# EAGLE design Hooly_2.023 (EAGLE 8.5.1)
SHT31 con connettore Tutto 1206 anzichè 0603 Con regolatore all'ingresso Variante Con quarzo non SMD Partitore a VBATT per misurare livello batteria
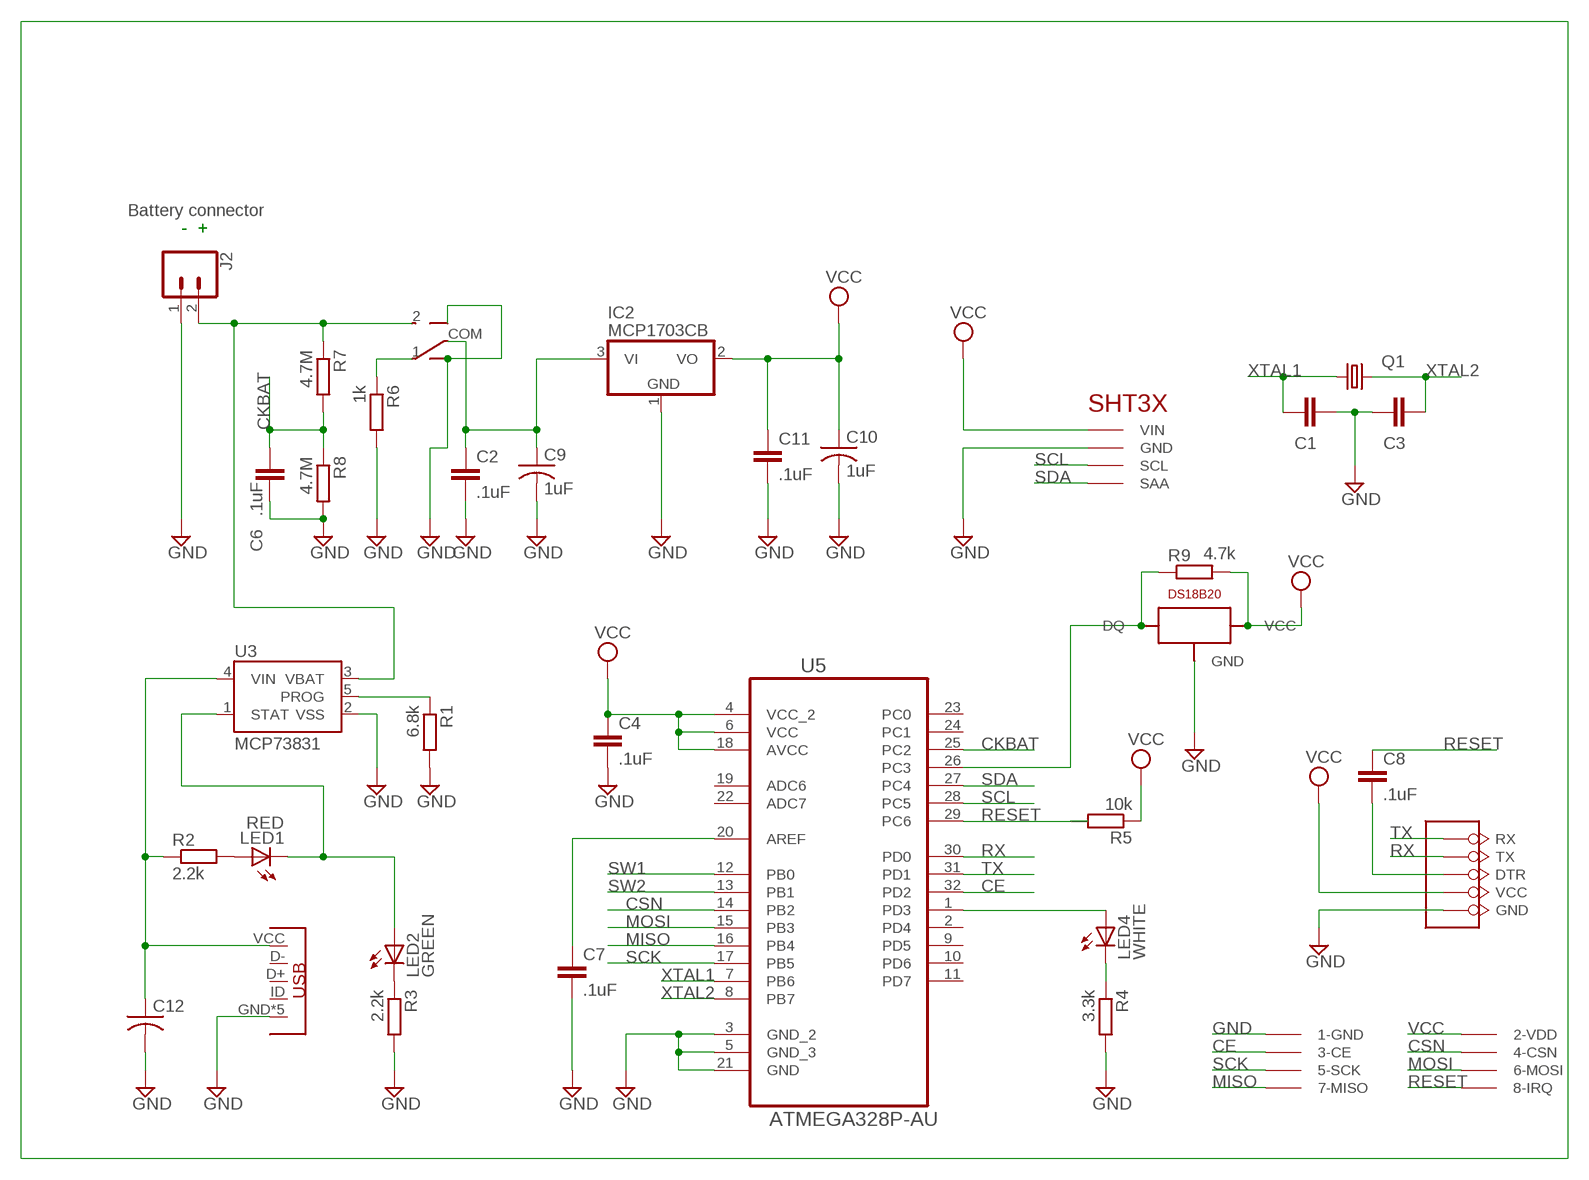
[diagram p0: schematic, sheet 1]

## Parts
C1  C-EUC0603K  [C0603K]
C2  .1uF  C-EUC0603  [C0603]
C3  C-EUC0603K  [C0603K]
C4  .1uF  C-EUC0603  [C0603]
C6  .1uF  C-EUC0603  [C0603]
C7  .1uF  C-EUC0603  [C0603]
C8  .1uF  C-EUC0603  [C0603]
C9  1uF  C-USC1206K  [C1206K]
C10  1uF  C-USC1206K  [C1206K]
C11  .1uF  C-EUC0603  [C0603]
C12  C-USC1206K  [C1206K]
IC2  MCP1703CB  [SOT23]
J2  CONN_02  [1X02]
LED1  RED  LEDCHIPLED_0603  [CHIPLED_0603]
LED2  GREEN  LEDCHIPLED_0603  [CHIPLED_0603]
LED4  WHITE  LEDCHIPLED_0603  [CHIPLED_0603]
Q1  KX-9B  [5.0X3.2_2]
R1  6.8k  R-EU_R0603  [R0603]
R2  2.2k  R-EU_R0603  [R0603]
R3  2.2k  R-EU_R0603  [R0603]
R4  3.3k  R-EU_R0603  [R0603]
R5  10k  R-EU_R0603  [R0603]
R6  1k  R-EU_R0603  [R0603]
R7  4.7M  R-EU_R0603  [R0603]
R8  4.7M  R-EU_R0603  [R0603]
R9  4.7k  R-EU_R0603  [R0603]
U3  MCP73831  [SOT23-5]
U5  ATMEGA328P-AU  [QFP80P900X900X120-32N]
U$1  SHT3XLARGE  [MYSHT3X]
U$2  MYSWITCH2MM  [MYSWITCH]
U$3  MYDS18B20  [MYDS18B20]
U$4  MYNRF24L01SOCKET  [MYNRF24L01SOCKET]
U$6  FTDI232  [FTDI232]
U$7  MYMICROUSB  [MYMICROUSB]

## Nets
CE: U5.32(PD2) U$4.CE(3-CE)
CKBAT: C6.1 R7.2 R8.1 U5.25(PC2)
CSN: U5.14(PB2) U$4.CSN(4-CSN)
DTR: C8.2 U$6.DTR
GND: C1.2 C2.2 C3.1 C4.2 C6.2 C7.2 C9.2 C10.2 C11.2 C12.2 IC2.1(GND) J2.1 R1.2 R3.2 R4.2 R6.2 R8.2 U3.2(VSS) U5.3(GND_2) U5.5(GND_3) U5.21(GND) U$1.GND U$2.GND1 U$2.GND2 U$3.GND U$4.GND(1-GND) U$6.GND U$7.GND U$7.P$6(GND) U$7.P$7(GND) U$7.P$8(GND) U$7.P$9(GND)
MISO: U5.16(PB4) U$4.MISO(7-MISO)
MOSI: U5.15(PB3) U$4.MOSI(6-MOSI)
N$2: C2.1 C9.1 IC2.3(VI) U$2.COM
N$3: LED4.A U5.1(PD3)
N$5: LED1.A R2.2
N$7: LED2.C R3.1
N$8: LED1.C LED2.A U3.1(STAT)
N$9: R6.1 U$2.1
N$10: R1.1 U3.5(PROG)
N$12: C7.1 U5.20(AREF)
N$13: R9.1 U5.26(PC3) U$3.DQ
N$14: LED4.C R4.1
RESET: C8.1 R5.2 U5.29(PC6) U$4.IRQ(8-IRQ)
RX: U5.30(PD0) U$6.TX
SCK: U5.17(PB5) U$4.SCK(5-SCK)
SCL: U5.28(PC5) U$1.SCL
SDA: U5.27(PC4) U$1.SAA
SW1: U5.12(PB0)
SW2: U5.13(PB1)
TX: U5.31(PD1) U$6.RX
VBATT: J2.2 R7.1 U3.3(VBAT) U$2.2
VCC: C4.1 C10.1 C11.1 IC2.2(VO) R5.1 R9.2 U5.4(VCC_2) U5.6(VCC) U5.18(AVCC) U$1.VIN U$3.VCC U$4.VDD(2-VDD) U$6.VCC
VUSB: C12.1 R2.1 U3.4(VIN) U$7.VCC
XTAL1: C1.1 Q1.1 U5.7(PB6)
XTAL2: C3.2 Q1.2 U5.8(PB7)
Unconnected: U5.2(PD4) U5.9(PD5) U5.10(PD6) U5.11(PD7) U5.19(ADC6) U5.22(ADC7) U5.23(PC0) U5.24(PC1) U$7.D+ U$7.D- U$7.ID

## Notes on the sheet
- Battery connector
- -  + | -  + | -  + | -  + | -  +

## Library data of the parts
C1 C3 = rcl:C-EU: CAPACITOR, European symbol; SPICEPREFIX: C
C2 C4 C6-C8 C11 = resistor:C-EU: CAPACITOR, European symbol
C9 C10 C12 = resistor:C-US: CAPACITOR, American symbol
IC2 = linear:MCP1703: 250 mA, 16V, Low Quiescent Current LDO Regulator Source: http://ww1.microchip.com/downloads/en/DeviceDoc/22049b.pdf
J2 = SparkFun-Connectors:CONN_02: Multi connection point. Often used as Generic Header-pin footprint for 0.1 inch spaced/style header connections On any of the 0.1 inch spaced packages, you can populate with these: Break Away Headers - Straight <https://www.sparkfun.com/products/116> (PRT-00116) Break Away Male Headers - Right Angle <https://www.sparkfun.com/products/553> (PRT-00553) Female Headers <https://www.sparkfun.com/products/115> (PRT-00115) Break Away Headers - Machine Pin <https://www.sparkfun.com/products/117> (PRT-00117) Break Away Female Headers - Swiss Machine Pin <https://www.sparkfun.com/products/743> (PRT-00743) For SCREWTERMINALS and SPRING TERMINALS visit here: Screw Terimnals on SparkFun.com <https://www.sparkfun.com/search/results?term=Screw+Terminals> (5mm/3.5mm/2.54mm spacing) This device is also useful as a general connection point to wire up your design to another part of your project. Our various solder wires solder well into these plated through hole pads. Hook-Up Wire - Assortment (Stranded, 22 AWG) <https://www.sparkfun.com/products/11375> (PRT-11375) Hook-Up Wire - Assortment (Solid Core, 22 AWG) <https://www.sparkfun.com/products/11367> (PRT-11367) View the entire wire category on our website here <https://www.sparkfun.com/categories/141> Special notes: Molex polarized connector foot print use with: PRT-08233 with associated crimp pins and housings. 2.54_SCREWTERM for use with PRT-10571. 3.5mm Screw Terminal footprints for PRT-08084 5mm Screw Terminal footprints for use with PRT-08432
LED1 LED2 LED4 = led:LED: LED OSRAM: - CHIPLED LG R971, LG N971, LY N971, LG Q971, LY Q971, LO R971, LY R971 LH N974, LH R974 LS Q976, LO Q976, LY Q976 LO Q996 - Hyper CHIPLED LW Q18S LB Q993, LB Q99A, LB R99A - SideLED LS A670, LO A670, LY A670, LG A670, LP A670 LB A673, LV A673, LT A673, LW A673 LH A674 LY A675 LS A676, LA A676, LO A676, LY A676, LW A676 LS A679, LY A679, LG A679 - Hyper Micro SIDELED® LS Y876, LA Y876, LO Y876, LY Y876 LT Y87S - SmartLED LW L88C, LW L88S LB L89C, LB L89S, LG L890 LS L89K, LO L89K, LY L89K LS L896, LA L896, LO L896, LY L896 - TOPLED LS T670, LO T670, LY T670, LG T670, LP T670 LSG T670, LSP T670, LSY T670, LOP T670, LYG T670 LG T671, LOG T671, LSG T671 LB T673, LV T673, LT T673, LW T673 LH T674 LS T676, LA T676, LO T676, LY T676, LB T676, LH T676, LSB T676, LW T676 LB T67C, LV T67C, LT T67C, LS T67K, LO T67K, LY T67K, LW E67C LS E67B, LA E67B, LO E67B, LY E67B, LB E67C, LV E67C, LT E67C LW T67C LS T679, LY T679, LG T679 LS T770, LO T770, LY T770, LG T770, LP T770 LB T773, LV T773, LT T773, LW T773 LH T774 LS E675, LA E675, LY E675, LS T675 LS T776, LA T776, LO T776, LY T776, LB T776 LHGB T686 LT T68C, LB T68C - Hyper Mini TOPLED® LB M676 - Mini TOPLED Santana® LG M470 LS M47K, LO M47K, LY M47K Source: http://www.osram.convergy.de LUXEON: - LUMILED® LXK2-PW12-R00, LXK2-PW12-S00, LXK2-PW14-U00, LXK2-PW14-V00 LXK2-PM12-R00, LXK2-PM12-S00, LXK2-PM14-U00 LXK2-PE12-Q00, LXK2-PE12-R00, LXK2-PE12-S00, LXK2-PE14-T00, LXK2-PE14-U00 LXK2-PB12-K00, LXK2-PB12-L00, LXK2-PB12-M00, LXK2-PB14-N00, LXK2-PB14-P00, LXK2-PB14-Q00 LXK2-PR12-L00, LXK2-PR12-M00, LXK2-PR14-Q00, LXK2-PR14-R00 LXK2-PD12-Q00, LXK2-PD12-R00, LXK2-PD12-S00 LXK2-PH12-R00, LXK2-PH12-S00 LXK2-PL12-P00, LXK2-PL12-Q00, LXK2-PL12-R00 Source: www.luxeon.com KINGBRIGHT: KA-3528ASYC Source: www.kingbright.com
Q1 = crystal-geyer_V1_0:KX: Quartz Crystals (MHz) SMD: KX - Serie Model Size l/w/h [mm] Frequency Range Frequency Stability Temp. Range [°C] Load Capacitance AECQ 200 availabel Datasheet KX-4 KX-5 KX-6 KX-7 KX-9A KX-9B KX-12A KX-12B KX-13 KX-20 KX-K KX-KS 1.6/1.2/0.3 2.0/1.6/0.45 2.5/2.0/0.55 3.2/2.5/0.8 5.0/3.2/1.0 5.0/3.2/1.1 6.0/3.5/1.1 6.0/3.5/1.0 7.0/5.0 /1.3 11.6/5.5/1.6 12.3/4.5/4.2 12.3/4.5/3.2 24.0 ~ 80.0 MHz 16.0 ~ 80.0 MHz 12.0 ~ 80.0 MHz 8.0 ~ 60.0 MHz 7,68 ~ 300,0 MHz 8,0 ~ 50,0 MHz 8,0 ~ 150,0 MHz 8,0 ~ 50,0 MHz 6,0 ~ 160,0 MHz 3,579 ~ 25,0 MHz 3,579 ~ 70,0 MHz 3,579 ~ 70,0 MHz ±10 … ±50ppm ±10 … ±50ppm ±10 … ±50ppm ±10 … ±50ppm ±10 … ±50ppm ±10 … ±50ppm ±10 … ±50ppm ±10 … ±50ppm ±10 … ±50ppm ±50ppm ±10 … ±50ppm ±10 … ±50ppm (*) -40°C …+85°C (*) -40°C …+125°C (*) -40°C …+125°C (*) -40°C …+125°C (*) -40°C …+105°C (*) -40°C …+105°C (*) -40°C …+125°C (*) -40°C …+105°C (*) -40°C …+105°C (*) -40°C …+105°C (*) -40°C …+85°C (*) -40°C …+85°C 8, 8…16 8, 8…16 10, 8…16 12, 7…20 16, 10…20 16, 10…20 16, 10…20 16, 12…20 16, 12…20 16, 12…20 16, 12…30 16, 12…30 - yes yes yes - - - - - - - - KX-4.pdf <http://www.geyer-electronic.de/uploads/tx_userartikelfrequenz/GEYER-KX-4.pdf> KX-5.pdf <http://www.geyer-electronic.de/uploads/tx_userartikelfrequenz/GEYER-KX-5.pdf> KX-6.pdf <http://www.geyer-electronic.de/uploads/tx_userartikelfrequenz/GEYER-KX-6.pdf> KX-7.pdf <http://www.geyer-electronic.de/uploads/tx_userartikelfrequenz/GEYER-KX-7.pdf> KX-9A.pdf <http://www.geyer-electronic.de/uploads/tx_userartikelfrequenz/GEYER-KX-9A.pdf> KX-9B.pdf <http://www.geyer-electronic.de/uploads/tx_userartikelfrequenz/GEYER-KX-9B.pdf> KX-12A.pdf <http://www.geyer-electronic.de/uploads/tx_userartikelfrequenz/GEYER-KX-12A.pdf> KX-12B.pdf <http://www.geyer-electronic.de/uploads/tx_userartikelfrequenz/GEYER-KX-12B.pdf> KX-13.pdf <http://www.geyer-electronic.de/uploads/tx_userartikelfrequenz/GEYER-KX-13.pdf> KX-20.pdf <http://www.geyer-electronic.de/uploads/tx_userartikelfrequenz/GEYER-KX-20.pdf> KX-K.pdf <http://www.geyer-electronic.de/uploads/tx_userartikelfrequenz/GEYER-KX-K.pdf> KX-KS.pdf <http://www.geyer-electronic.de/uploads/tx_userartikelfrequenz/GEYER-KX-KS.pdf> <http://www.geyer-electronic.de/fileadmin/template/img/logo-geyer-electronic.png> Details see: http://www.geyer-electronic.de/Frequenz-Produkte.9.0.html Created 2016-06-07, Hans Locher 2016 (C) Geyer Quartz Technology KX4,KX5,KX6,KX7,KX9A,KX9B,KX12A,KX12B,KX13,KX20,KXK,KXKS;1612;2016;2520;3225;5032;6035;7050;11655;12345;1,6x1,2;2,0x1,6;2,5x2,0;3,2x2,5;5,0x3,2;6,0x3,5;7,0x5,0;11,6x5,5;12,3x4,5;12,3x4,5;1.6x1.2;2.0x1.6;2.5x2.0;3.2x2.5;5.0x3.2;6.0x3.5;7.0x5.0;11.6x5.5;12.3x4.5;12.3x4.5;
R1-R9 = rcl:R-EU_: RESISTOR, European symbol
U3 = SparkFun-IC-Power:MCP73831: MCP73831T Li-Ion, Li-Pol Controller Miniature single cell, fully integrated Li-Ion, Li-polymer charge management controller Datasheet <http://ww1.microchip.com/downloads/en/DeviceDoc/20001984g.pdf> SparkFun Products: SparkFun ESP32 Thing <https://www.sparkfun.com/products/13907> SparkFun 9DoF Razor IMU M0 <https://www.sparkfun.com/products/14001>; PROD_ID: IC-09995
U5 = Atmel_By_element14_Batch_1-00:ATMEGA328P-AU: 8-bit Microcontroller with In-System Programmable Flash; MPN: ATMEGA328P-AU; OC_FARNELL: 1715486; OC_NEWARK: 14R4631; PACKAGE: TQFP-32; SUPPLIER: Atmel
U$1 = My_library:SHT3X
U$2 = My_library:MYSWITCH2MM: Slide switch 2mm pitch
U$3 = My_library:MYDS18B20
U$4 = My_library:MYNRF24L01SOCKET
U$6 = My_library:FTDI232
U$7 = My_library:MYMICROUSB: MicroUSB connectori SMD https://it.aliexpress.com/item/100pcs-Micro-USB-Connector-5pin-Seat-Jack-Micro-usb-Four-legs-5P-Inserting-plate-seat-MIni/32708224969.html?spm=a2g0s.13010208.99999999.262.eblQws

## Board
Come 2.022, f.to 0603
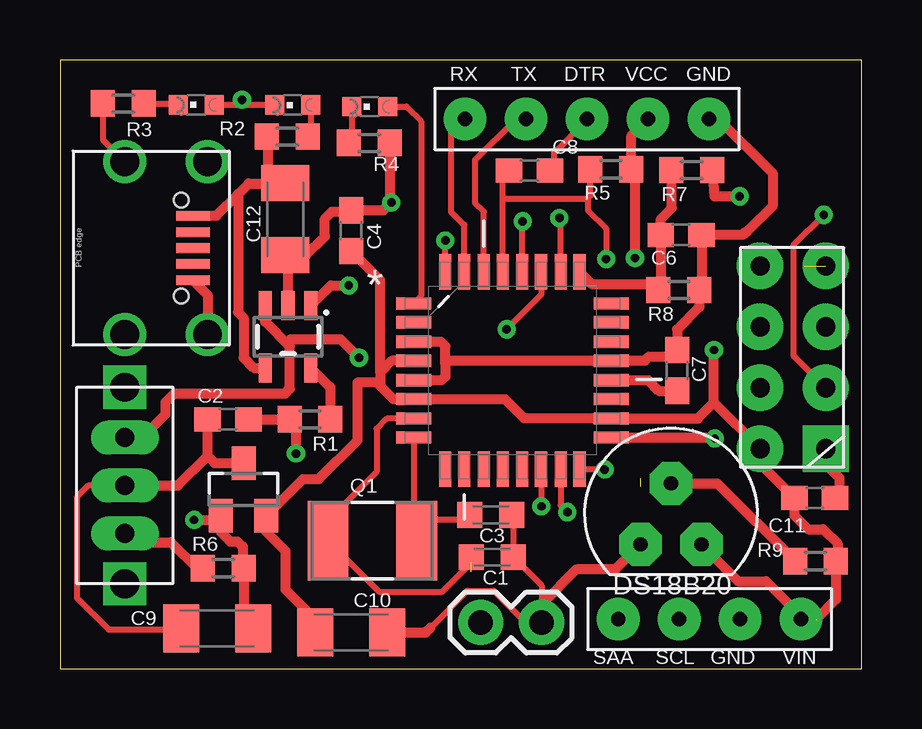
[diagram p1: board, top side]
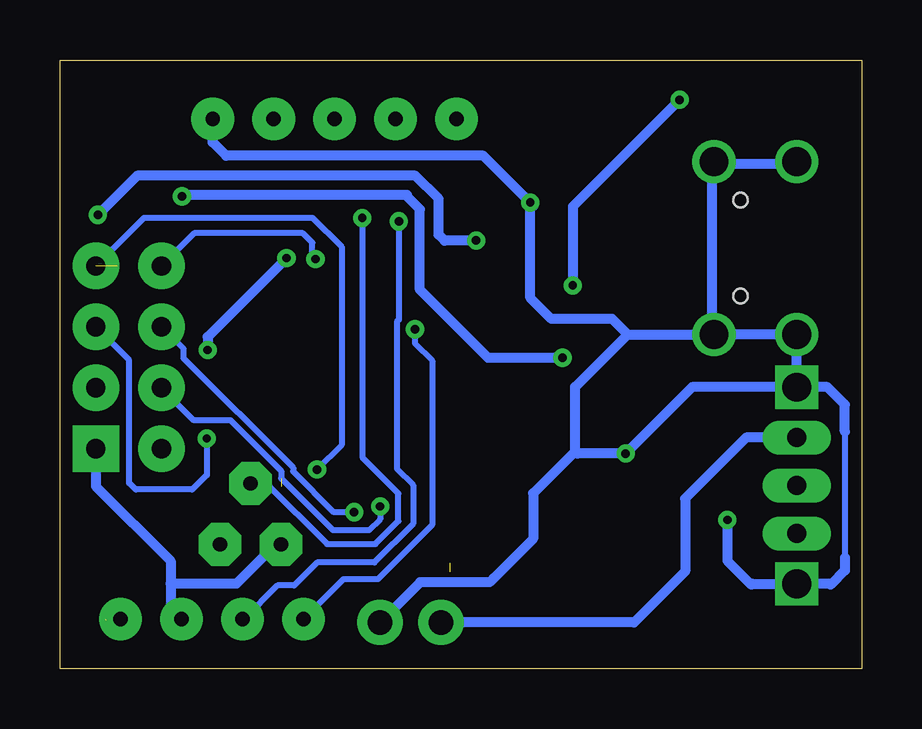
[diagram p2: board, bottom side, seen from below]

Size 33.4 x 25.38 mm. Coordinates in mm from the lower left corner, seen from the top.
Outline: 0,0 33.4,0 33.4,25.38 0,25.38 0,0
Copper layers (1*16): Top 0.035mm / dielectric 1.5mm / Bottom 0.035mm
Design rules "default *": minimum track width 6mil, minimum drill 0.35mm, track to track 7mil, track to pad 10mil, pad to pad 6mil, via to via 6mil, smd to smd 6mil, copper to edge 20mil, drill to drill 2mil, minimum pad ring 10mil, minimum via ring 8mil, stop-mask expansion 4mil, vias tented up to drill 0mil, thermal gap 10mil

### Footprints (pad centres in the part's own frame; a part is rotated, then mirrored left to right if it is on the bottom)
C0603K = smd 1.05 x 1.08: 1 -0.875,0; 2 0.875,0
C0603 = smd 1.1 x 1: 1 -0.85,0; 2 0.85,0
C1206K = smd 1.5 x 2: 1 -1.5,0; 2 1.5,0
SOT23 = smd 1 x 1.4: 1 -0.95,-1.1; 2 0.95,-1.1; 3 0,1.1
1X02 = drill 1.016 pad 1.88: 1 0,0; 2 2.54,0
CHIPLED_0603 = smd 0.8 x 0.8: A 0,-0.75; C 0,0.75
5.0X3.2_2 = smd 1.7 x 3.3: 1 -1.85,0; 2 1.85,0
R0603 = smd 1 x 1.1: 1 -0.85,0; 2 0.85,0
SOT23-5 = smd 0.55 x 1.2: 1 -0.95,-1.3; 2 0,-1.3; 3 0.95,-1.3; 4 0.95,1.3; 5 -0.95,1.3
QFP80P900X900X120-32N = smd 1.473 x 0.508: 1 -4.115,2.794; 2 -4.115,2.007; 3 -4.115,1.194; 4 -4.115,0.406; 5 -4.115,-0.406; 6 -4.115,-1.194; 7 -4.115,-2.007; 8 -4.115,-2.794; 17 4.115,-2.794; 18 4.115,-2.007; 19 4.115,-1.194; 20 4.115,-0.406; 21 4.115,0.406; 22 4.115,1.194; 23 4.115,2.007; 24 4.115,2.794 | smd 0.508 x 1.473: 9 -2.794,-4.115; 10 -2.007,-4.115; 11 -1.194,-4.115; 12 -0.406,-4.115; 13 0.406,-4.115; 14 1.194,-4.115; 15 2.007,-4.115; 16 2.794,-4.115; 25 2.794,4.115; 26 2.007,4.115; 27 1.194,4.115; 28 0.406,4.115; 29 -0.406,4.115; 30 -1.194,4.115; 31 -2.007,4.115; 32 -2.794,4.115
MYSHT3X = drill 0.6 pad 1.778: GND -3.81,0; SAA 1.27,0; SCL -1.27,0; VIN -6.35,0
MYSWITCH = drill 0.8 pad 1.422 long: 1 -2,0; 2 2,0; COM 0,0 | drill 1.2 square: GND1 -4.1,0; GND2 4.1,0
MYDS18B20 = drill 0.6 pad 1.778 octagon: DQ 0,-1.27; GND 1.27,1.27; VCC -1.27,1.27
MYNRF24L01SOCKET = drill 0.8 pad 1.93: CE 0,2.54; CSN -2.731,2.54; IRQ -2.731,7.62; MISO 0,7.62; MOSI -2.731,5.08; SCK 0,5.08; VDD -2.731,0 | drill 0.8 pad 1.93 square: GND 0,0
FTDI232 = drill 0.6 pad 1.778: DTR 3.81,0; GND 8.89,0; RX -1.27,0; TX 1.27,0; VCC 6.35,0
MYMICROUSB = smd 0.4 x 1.4: D+ 0,5; D- -0.65,5; GND 1.35,5; ID 0.65,5; VCC -1.35,5 | drill 1.2: P$6 -3.6,2.15; P$7 3.6,2.15; P$8 3.6,5.6; P$9 -3.6,5.6 | hole 0.6: -2,4.5; 2,4.5

### Placement (x,y rotation side)
C1  18.01,4.65 0 top
C2  7,10.4 0 top
C3  17.95,6.42 180 top
C4  12.13,18.26 90 top
C6  25.88,18.08 0 top
C7  25.71,12.43 90 top
C8  19.56,20.76 0 top
C9  6.54,1.67 0 top
C10  12.13,1.51 0 top
C11  31.45,7.11 0 top
C12  9.38,18.74 270 top
IC2  7.65,7.47 0 top
J2  20.06,1.92 180 top
LED1  9.7,23.5 90 top
LED2  5.68,23.51 90 top
LED4  12.91,23.43 90 top
Q1  13.02,5.33 0 top
R1  10.42,10.39 180 top
R2  9.46,22.18 0 top
R3  2.64,23.56 180 top
R4  12.89,21.92 0 top
R5  22.95,20.82 180 top
R6  6.8,4.19 0 top
R7  26.32,20.78 180 top
R8  25.79,15.78 0 top
R9  31.48,4.48 0 top
U3  9.5,13.84 180 top
U5  18.85,12.43 0 top
U$1  24.53,2.07 180 top
U$2  2.7,7.64 90 top
U$3  25.46,6.45 180 top
U$4  31.9,9.17 0 top
U$6  18.15,22.91 0 top
U$7  0.55,17.54 270 top

### Tracks (layer width: path | path; a pad name or v marks a point on that pad's centre or on a via)
CE  (via drill 0.35)
  Top 0.152: 16.08,16.47 U5.32 16.06,17.27
  Top 0.254: U5.32 v16.06,17.85 | v31.82,18.92 30.56,17.65 30.56,13.06 U$4.CE
  Bottom 0.406: v16.06,17.85 17.38,17.84 17.63,18.09 17.63,19.59 18.59,20.55 30.19,20.55 v31.82,18.92
CKBAT
  Top 0.152: 24.92,16.04 R8.1
  Top 0.406: U5.25 22.15,16.04 24.92,16.04 | 24.97,18.13 C6.1 | C6.1 25.03,15.88 R8.1 | C6.1 25.03,18.74 25.49,19.2 25.49,20.76 R7.2
CSN  (via drill 0.35)  (1 unrouted)
  Top 0.152: U5.14 20.06,8.3
  Top 0.254: U5.14 20.05,6.78 v20.06,6.76
  Bottom 0.254: U$4.CSN 27.82,10.35 26.29,10.35 24.19,8.25 24.19,7.93 22.02,5.76 20.53,5.76 20.06,6.23 v20.06,6.76
DTR
  Top 0.254: 20.06,20.66 C8.2 20.59,20.94 20.59,21.5 21.96,22.87 U$6.DTR
GND  (via drill 0.35)
  Top 0.152: R3.2 2.13,23.31 | U$6.GND 27.06,22.94 | 9.5,17.12 C12.2 10.08,17.24 | 12.08,19.05 C4.2 | C11.2 31.9,6.76
  Top 0.254: R4.2 13.8,21.85 | R3.2 1.79,22.05 U$7.P$6 | IC2.1 6.7,6.56 | 9.83,8.75 v9.83,8.97 | C3.1 18.88,6.35 C1.2 20.06,3.47 J2.1 19.39,1.92 18.07,3.24 16.98,3.24 15.44,1.71
  Top 0.406: U5.3 15.88,13.63 16.06,13.45 16.06,12.69 | 16.06,12.69 16.06,12.18 15.91,12.03 U5.5 | 16.06,12.69 16.21,12.84 U5.21 24.37,12.84 24.54,13.01 25.44,13.01 C7.2 25.71,14.14 26.64,15.07 R8.2 26.73,15.88 C6.2 28.45,18.08 28.58,18.21 28.62,18.21 29.69,19.28 29.69,20.66 27.43,22.91 U$6.GND | 9.46,10.5 R1.2 | R1.2 9.83,10.13 v9.83,8.97 | 7.37,4.48 7.62,4.23 | 7.62,4.23 R6.2 7.65,1.68 C9.2 | U$4.GND 31.9,8.52 32.48,7.94 32.48,7.29 C11.2 | U$3.GND 23.14,4.13 21.51,4.13 20.06,2.69 J2.1 | C12.2 10.25,17.24 11.03,18.02 11.03,18.76 11.32,19.05 12.08,19.05 | C4.2 13.48,19.11 v13.8,19.43 13.74,19.5 R4.2 | U3.2 9.5,17.12 | U$7.GND 6.15,15.59 U$7.P$8 | C10.2 15.24,1.51 15.44,1.71 | v5.59,6.2 6.59,6.2 6.73,6.34 IC2.1 6.7,5.69 7.09,5.3 7.39,5.3 7.62,5.08 7.62,4.23 | C2.2 R1.2
  Bottom 0.152: 2.82,13.94 U$7.P$7 | 12.03,8.97 12.4,8.6
  Bottom 0.254: 2.59,3.54 U$2.GND1 | 0.7,9.89 0.7,4.63
  Bottom 0.406: 11.93,9.06 12.4,8.6 13.68,7.31 13.68,5.41 15.33,3.76 | 11.93,9.06 11.93,11.75 9.75,13.94 | v13.8,19.43 15.76,21.39 26.48,21.39 27.04,21.94 U$6.GND | 28.79,3.54 28.79,4.49 31.9,7.61 U$4.GND | 28.79,3.54 28.79,2.51 U$1.GND | U$3.GND 24.42,5.18 26.05,3.54 28.79,3.54 | 15.33,3.77 15.33,3.76 | 11.93,9.06 11.84,8.97 v9.83,8.97 7.06,11.74 U$2.GND2 | U$2.GND2 2.7,13.82 2.82,13.94 | v13.8,19.43 13.67,19.3 | 9.75,13.94 6.25,13.94 | 6.25,13.94 U$7.P$8 U$7.P$7 | U$7.P$9 6.25,21.03 | 6.25,21.03 6.25,13.94 | U$7.P$6 2.8,21.03 6.25,21.03 | 9.75,13.94 10.39,14.58 12.93,14.58 13.8,15.45 v13.8,19.43 | 15.33,3.76 15.49,3.6 18.39,3.6 J2.1 | v5.59,6.2 5.59,4.5 4.59,3.5 4.56,3.54 2.59,3.54 1.32,3.54 1.29,3.5 0.7,4.1 0.7,4.63 | 0.7,9.89 0.7,11.01 1.42,11.74 U$2.GND2
MISO  (via drill 0.35)  (1 unrouted)
  Top 0.152: U5.16 21.72,8.25
  Top 0.254: U5.16 22.67,8.32 v22.69,8.3
  Bottom 0.254: U$4.MISO 29.89,18.8 22.88,18.8 21.67,17.59 21.67,9.32 v22.69,8.3
MOSI  (via drill 0.35)
  Top 0.152: U5.15 21.01,8.17
  Top 0.254: U5.15 20.86,6.81 v21.14,6.52
  Bottom 0.254: v21.14,6.52 21.99,6.52 23.69,8.22 23.69,8.38 28.26,12.95 28.26,13.34 U$4.MOSI
N$2
  Top 0.254: U$2.COM 1.18,7.64 0.71,7.16 0.71,2.95 2.02,1.63 4.6,1.63 C9.1
  Top 0.406: U$2.COM 4.91,7.64 6.15,8.87 | 6.15,8.87 C2.1 | 6.15,8.87 6.44,8.57 IC2.3
N$3
  Top 0.152: 13.77,23.32 LED4.A
  Top 0.254: LED4.A 14.43,23.43 15.05,22.82 15.05,15.54 U5.1
N$5
  Top 0.152: 10.4,22.67 10.34,22.31 | 10.34,22.31 R2.2 | 10.45,22.42 10.34,22.31
  Top 0.254: LED1.A 10.45,22.31 R2.2
N$7
  Top 0.152: R3.1 3.54,23.51
  Top 0.254: R3.1 4.87,23.56 LED2.C
N$8  (via drill 0.35)
  Top 0.152: 8.73,23.72 LED1.C
  Top 0.254: LED2.A 7.37,23.51 v7.58,23.72 7.8,23.5 LED1.C
  Top 0.406: U3.1 11.29,15.98 v12.03,15.98
  Bottom 0.406: v7.58,23.72 12.03,19.27 v12.03,15.98
N$9
  Top 0.406: U$2.1 3.07,5.26 4.62,5.26 5.69,4.19 R6.1
N$10
  Top 0.152: U3.5 10.45,12.2
  Top 0.406: U3.5 11.27,11.72 R1.1
N$12
  Top 0.152: 23.06,12.12 U5.20
  Top 0.406: U5.20 24.51,12.03 24.96,11.58 C7.1
N$13  (via drill 0.35)
  Top 0.254: U5.26 20.86,18.74 v20.8,18.79
  Top 0.406: U$3.DQ 27.39,7.72 R9.1
  Bottom 0.254: 24.93,7.72 U$3.DQ 24.8,7.72 22.27,5.19 20.26,5.19 19.3,6.15 19.3,7.3 20.8,8.81 v20.8,18.79
N$14
  Top 0.152: 12.13,22.01 R4.1
  Top 0.254: LED4.C 12.16,22.04 12.13,22.01
RESET  (via drill 0.35)
  Top 0.254: v22.75,17.08 22.75,18.34 21.99,19.1 21.99,19.6 | C8.1 18.45,20.49 18.45,19.6 | U5.29 18.45,19.6 | 18.45,19.6 21.99,19.6 | 21.99,19.6 22.1,19.71 R5.2
  Bottom 0.254: v22.75,17.08 22.89,17.21 22.89,17.76 23.28,18.15 27.81,18.15 U$4.IRQ
RX
  Top 0.254: 17.58,16.62 U5.30 17.66,19.05 17.29,19.42 17.29,21.2 19,22.91 U$6.TX
SCK  (via drill 0.35)
  Top 0.152: 27.24,9.64 v27.28,9.6
  Top 0.406: U5.17 27.24,9.64
  Bottom 0.254: v27.28,9.6 27.28,8.07 27.89,7.46 30.24,7.46 30.52,7.74 30.52,12.87 U$4.SCK
SCL  (via drill 0.35)
  Top 0.152: 19.26,18.63 v19.28,18.65
  Top 0.254: U5.28 19.26,18.63
  Bottom 0.254: U$1.SCL 25.74,2.07 24.34,3.47 23.64,3.47 22.69,4.42 20.3,4.42 18.69,6.03 18.69,7.65 19.37,8.33 19.37,14.46 19.28,14.55 v19.28,18.65
SDA  (via drill 0.35)
  Top 0.152: 20.02,16.57 U5.27
  Top 0.254: U5.27 20.05,15.59 v18.61,14.15
  Bottom 0.254: U$1.SAA 21.59,3.73 20.15,3.73 18.08,5.8 17.99,5.89 17.89,5.99 17.89,12.85 18.61,13.56 v18.61,14.15
TX
  Top 0.254: 16.82,16.57 U5.31 16.84,18.49 16.3,19.04 16.3,22.34 U$6.RX
VBATT  (via drill 0.35)
  Top 0.152: U3.3 8.55,14.57
  Top 0.406: R7.1 27.26,19.69 v28.32,19.69 | 9.58,13.43 9.58,11.67 9.36,11.45 4.74,11.45 4.39,11.1 4.39,10.6 3.42,9.64 U$2.2 | 9.58,13.43 9.58,13.71 9.61,13.74 11.68,13.74 v12.46,12.96 | U3.3 8.55,14.46 9.58,13.43
  Bottom 0.406: v12.46,12.96 15.56,12.96 18.4,15.8 18.4,19.16 18.93,19.69 18.93,19.75 28.26,19.75 v28.32,19.69 | U$2.2 4.81,9.64 7.35,7.09 7.35,4.05 9.47,1.92 J2.2
VCC  (via drill 0.35)  (1 unrouted)
  Top 0.152: 31.33,1.91 31.4,1.95 31.5,2.01 | 32.52,4.29 R9.2 32.4,4.55 | C11.1 30.8,6.91 | IC2.2 8.4,5.79
  Top 0.254: 14.74,11.29 U5.6 | 14,12.84 U5.4 | 22.94,10.4 U5.18
  Top 0.406: 27.25,11.1 v27.25,13.28 | U5.4 13.83,12.84 13.34,12.35 | 13.34,12.35 13.34,12.01 | 13.34,12.01 13.34,11.79 13.89,11.24 U5.6 18.53,11.24 19.33,10.45 22.9,10.45 22.94,10.4 | 13.34,12.01 13.28,11.95 12.43,11.95 12.4,11.92 12.4,9.52 10.79,7.9 10.13,7.9 IC2.2 8.6,5.69 9.39,4.9 9.39,3.3 10.59,2.1 10.89,2.1 10.89,1.77 C10.1 | 13.34,12.35 13.34,16.2 C4.1 | 32.4,4.55 32.4,5.22 31.8,5.81 31.17,5.81 30.6,6.38 C11.1 29.17,8.54 U$4.VDD 27.25,11.1 | R9.2 32.33,2.88 31.51,2.07 U$1.VIN 30.88,2.19 29.42,3.65 28.26,3.65 U$3.VCC | U5.18 26.58,10.43 27.25,11.1 | v23.96,17.12 23.96,20.66 R5.1 23.8,22.22 U$6.VCC
  Bottom 0.406: v23.96,17.12 27.25,13.83 v27.25,13.28
VUSB
  Top 0.406: U$7.VCC 6.52,18.89 7.42,19.79 | 7.42,19.79 7.86,20.22 8.65,20.22 | 8.65,20.22 C12.1 | 7.42,19.79 7.42,14.85 7.65,14.62 7.65,12.97 8.08,12.54 U3.4 | R2.1 8.65,22.14 8.65,20.22
XTAL1  (1 unrouted)
  Top 0.254: Q1.1 11.29,5.21 | 11.29,5.21 13.3,3.2 15.93,3.2 17.13,4.4 C1.1 | U5.7 13.61,10.43 13.19,10 13.19,8.2 11.29,6.31 11.29,5.21
XTAL2
  Top 0.254: U5.8 14.74,6.2 | 14.74,6.2 14.74,5.46 Q1.2 | C3.2 16.86,6.2 14.74,6.2

### Text on the board
tValues: +